# Altium schematic sheet 04_Accelerometer.SchDoc
size A4; SheetNumber: 6; SheetTotal: 8
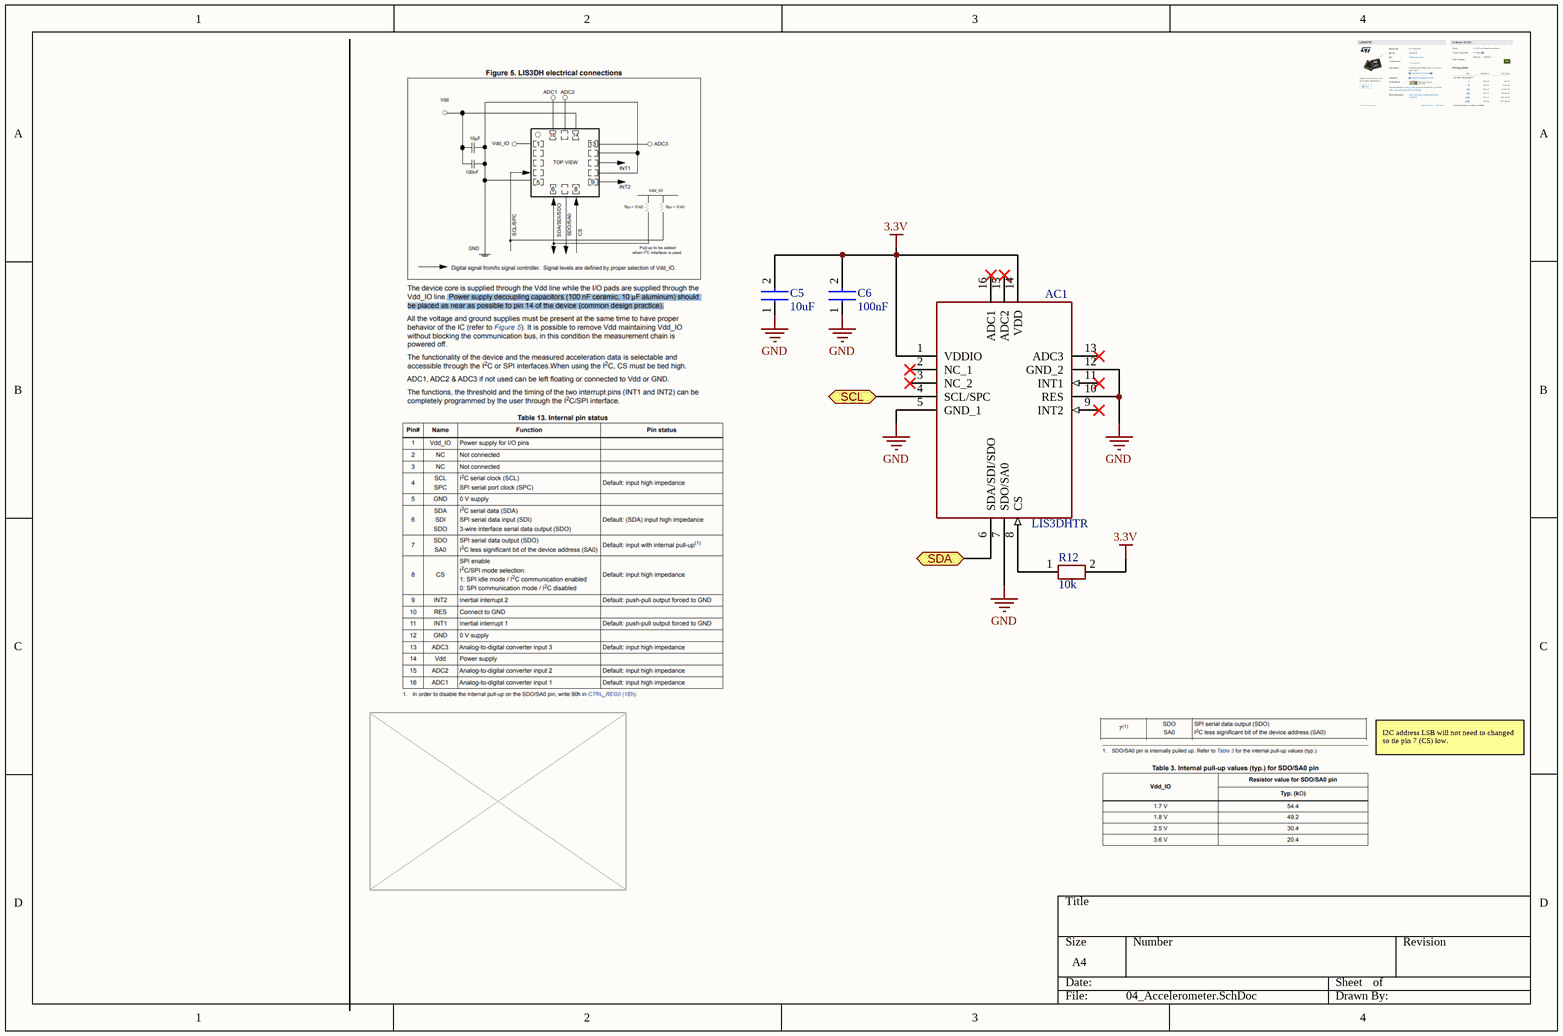
[diagram p0: 04_Accelerometer.SchDoc]

## Parts
AC1  LIS3DHTR  [LIS3DHTR]
C5  10uF  [CAPC2012X94N]
C6  100nF  [CAPC2012X94N]
R12  10k  [RESC2012X60N]

## Ports
SCL (bidir, see 01_Top[2C], 03_Temp_Sensor[4B], 04.2_Thermocouple_Handling_01[2B], 06_MCU[6D]), SDA (bidir, see 01_Top[2C], 03_Temp_Sensor[4B], 04.2_Thermocouple_Handling_01[2B], 06_MCU[6D])

## Nets
3.3V: AC1.1(VDDIO) AC1.14(VDD) C5.2 C6.2 R12.2
GND: AC1.5(GND_1) AC1.7(SDO/SA0) AC1.10(RES) AC1.12(GND_2) C5.1 C6.1
SCL: AC1.4(SCL/SPC) ; port SCL
SDA: AC1.6(SDA/SDI/SDO) ; port SDA
NetAC1_8: AC1.8(CS) R12.1

Not connected (* = marked no-connect by the designer): AC1 2(NC_1)* 3(NC_2)* 9(INT2)* 11(INT1)* 13(ADC3)* 15(ADC2)* 16(ADC1)*

## Notes on the sheet
- I2C address LSB will not need to changed so tie pin 7 (CS) low.

## Library data of the parts
AC1 = IC ACC MEMS 3-AXIS 11uA SMD: Accelerometer; Manufacturer_Part_Number: LIS3DHTR; ComponentLink1Description: Datasheet; ComponentLink1URL: https://www.mouser.co.za/datasheet/2/389/lis3dh-1849589.pdf
C5 = CAP CER 10uF 0805 SMD: Capacitor; Manufacturer_Part_Number: CL21A106KOQNNNE; ComponentLink1Description: Datasheet; ComponentLink1URL: https://www.mouser.co.za/datasheet/2/585/MLCC-1837944.pdf
C6 = CAP CER 100nF 0805 SMD: Capacitor; Manufacturer_Part_Number: 08055C104KAZ2A; ComponentLink1Description: Datasheet; ComponentLink1URL: http://datasheets.avx.com/X7RDielectric.pdf
R12 = RES 10K 0805 SMD: Resistor; Manufacturer_Part_Number: CR0805-FX-1002ELF